# EAGLE design Rocketometer2148 MPU9150 (EAGLE 6.2)
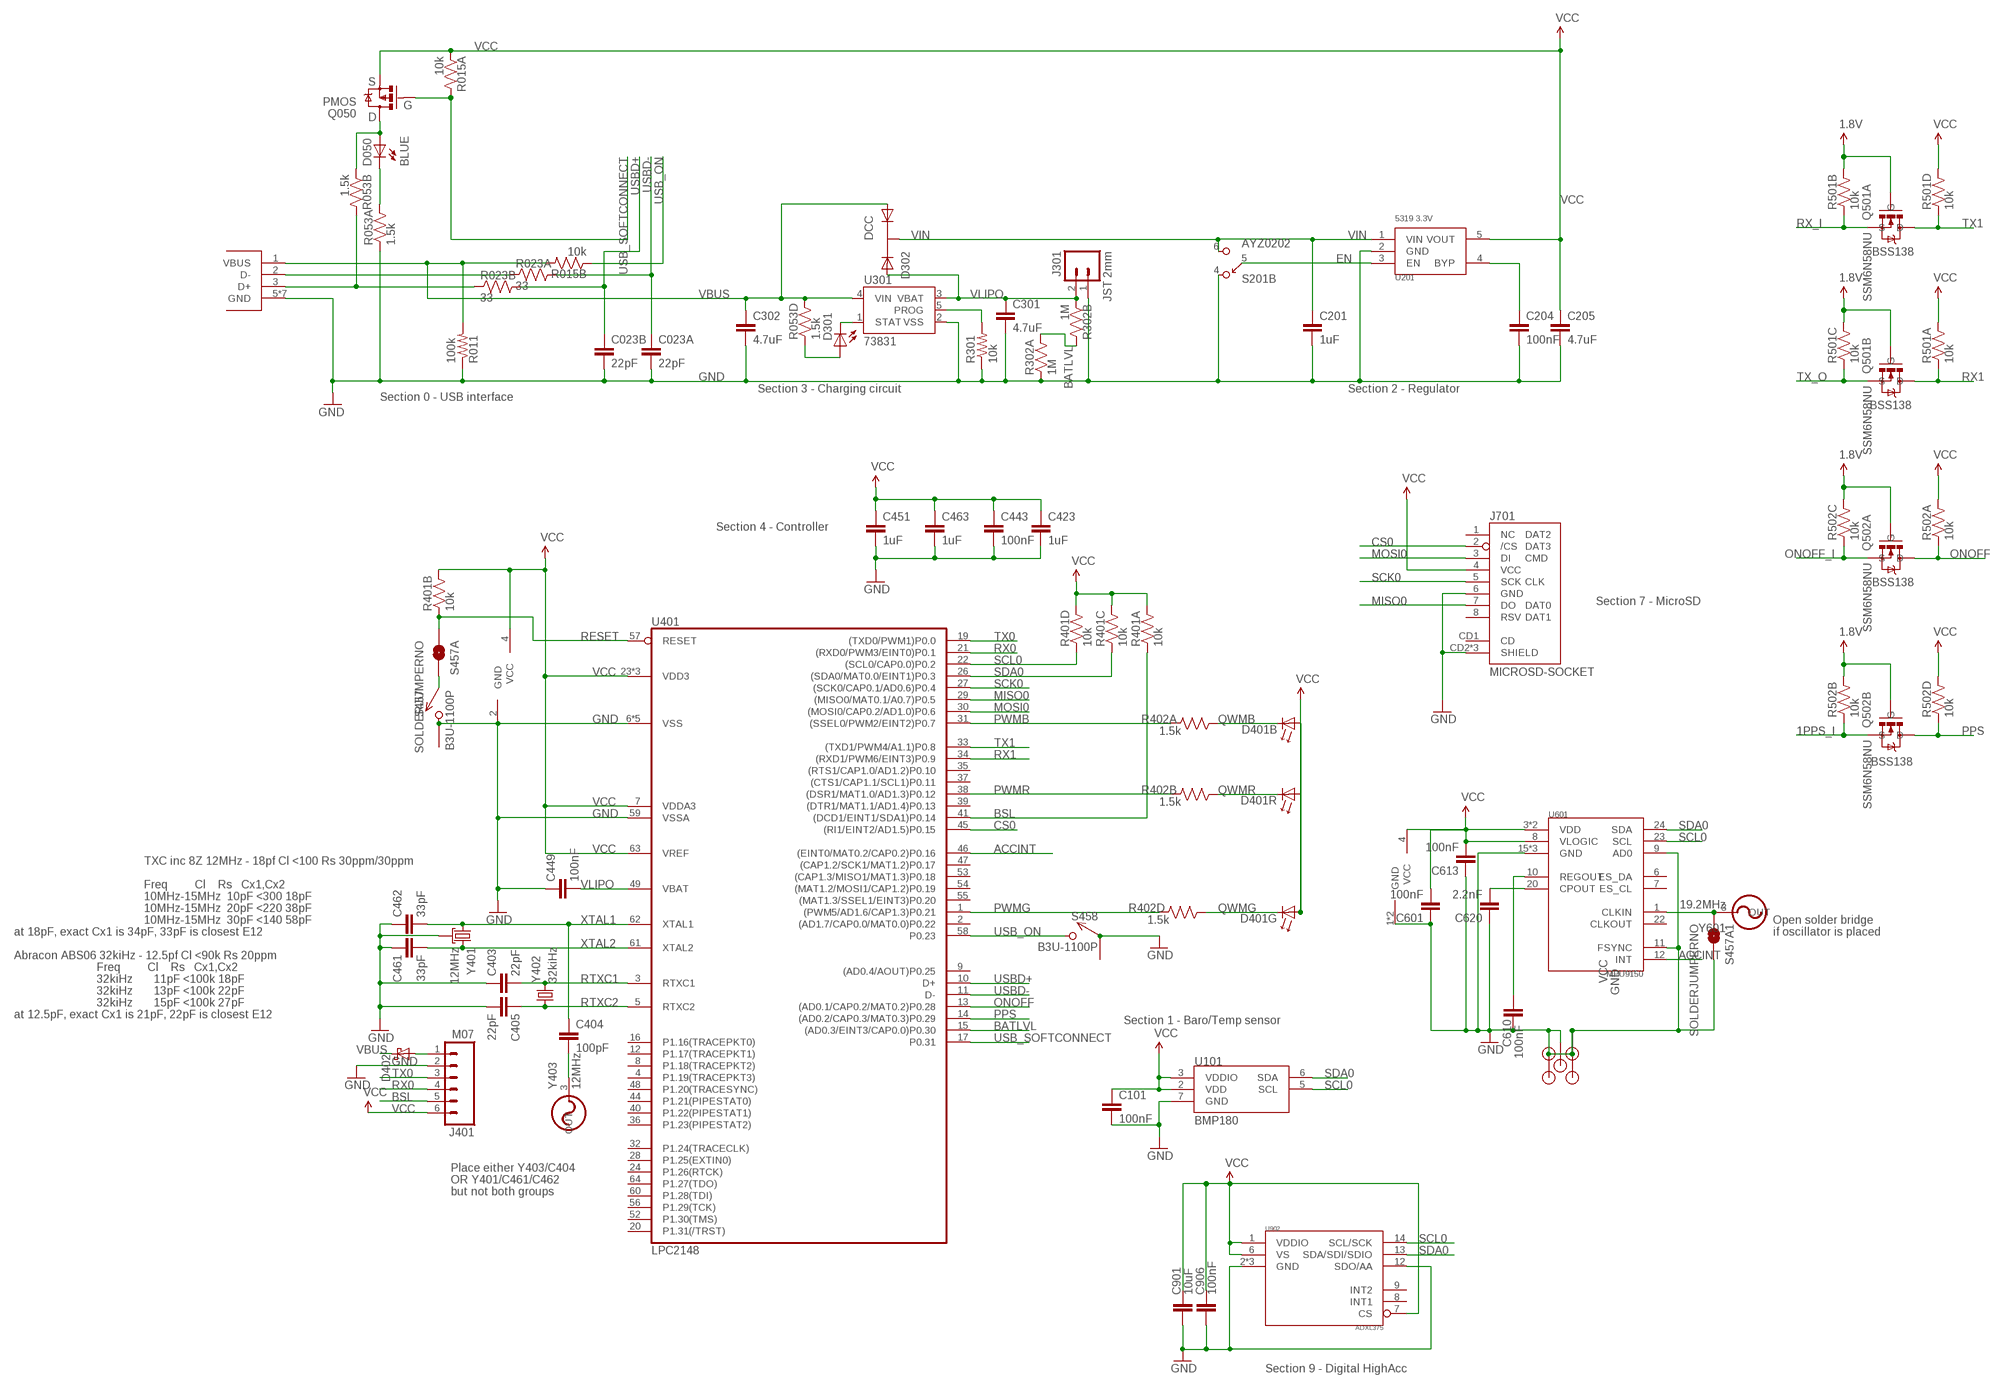
[diagram p0: schematic, sheet 1, part 1 of 2]
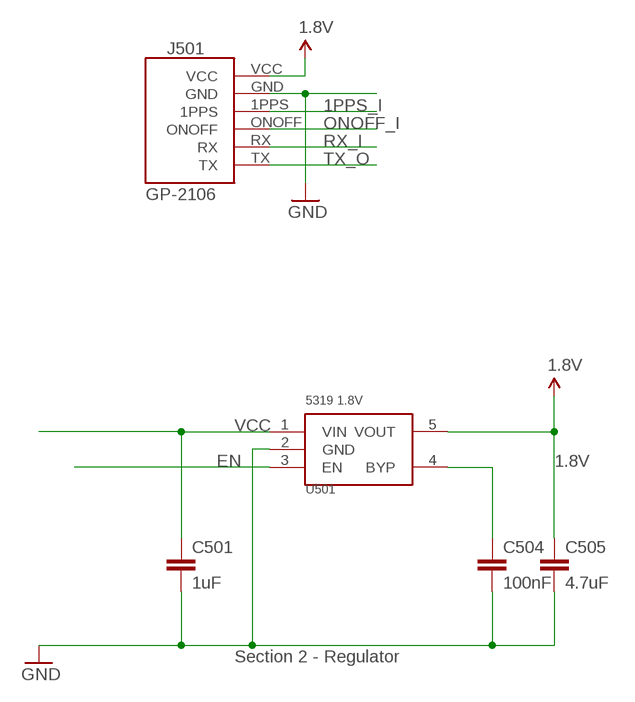
[diagram p1: schematic, sheet 1, part 2 of 2]

## Parts
C023  22pF  CKCM25  [CKCM25]
C101  100nF  CAP0402-CAP  [0402-CAP]
C201  1uF  CAP0402-CAP  [0402-CAP]
C204  100nF  CAP0402-CAP  [0402-CAP]
C205  4.7uF  CAP0402-CAP  [0402-CAP]
C301  4.7uF  CAP0402-CAP  [0402-CAP]
C302  4.7uF  CAP0402-CAP  [0402-CAP]
C403  22pF  CAP0402-CAP  [0402-CAP]
C404  100pF  CAP0402-CAP  [0402-CAP]
C405  22pF  CAP0402-CAP  [0402-CAP]
C423  1uF  CAP0402-CAP  [0402-CAP]
C443  100nF  CAP0402-CAP  [0402-CAP]
C449  100nF  CAP0402-CAP  [0402-CAP]
C451  1uF  CAP0402-CAP  [0402-CAP]
C461  33pF  CAP0402-CAP  [0402-CAP]
C462  33pF  CAP0402-CAP  [0402-CAP]
C463  1uF  CAP0402-CAP  [0402-CAP]
C501  1uF  CAP0402-CAP  [0402-CAP]
C504  100nF  CAP0402-CAP  [0402-CAP]
C505  4.7uF  CAP0402-CAP  [0402-CAP]
C601  100nF  CAP0402-CAP  [0402-CAP]
C610  100nF  CAP0402-CAP  [0402-CAP]
C613  100nF  CAP0402-CAP  [0402-CAP]
C620  2.2nF  CAP0402-CAP  [0402-CAP]
C901  10uF  CAP0603-CAP  [0603-CAP]
C906  100nF  CAP0402-CAP  [0402-CAP]
D050  BLUE  LED0603  [LED-0603]
D301  YELLOW  LED0603  [LED-0603]
D302  DCC  PMEG2005CT  [SOT-23-3]
D401  SMLP36RGB2W(R)  [SMLP36]
D402  DIODE_SCHOTTKY  [D0603]
J001  USB_MICROB_JSTGCT  [USB_MICROB_3075]
J301  JST 2mm  M02-JST-2MM-SMT  [JST-2-SMD]
J401  M07  M06SIP  [1X06]
J501  GP-2106  [GP-2106]
J701  MICROSD-SOCKET  [MICROSD-SOCKET-PP]
JP1  STANDOFF  [STANDOFF]
JP2  STANDOFF  [STANDOFF]
JP3  STANDOFF  [STANDOFF]
JP4  STANDOFF  [STANDOFF]
JP5  STANDOFF  [STANDOFF]
Q050  PMOS  MOSFET-PCHANNELSMD  [SOT23-3]
Q501  SSM6N58NU  [UDFN6]
Q502  SSM6N58NU  [UDFN6]
R011  100k  RESISTOR0402-RES  [0402-RES]
R015  10k  RP2EXB24V  [CRA02]
R023  33  RP2EXB24V  [CRA02]
R053  1.5k  RP404  [CRA04]
R301  10k  RESISTOR0402-RES  [0402-RES]
R302  1M  RP2EXB24V  [CRA02]
R401  10k  RP404  [CRA04]
R402  1.5k  RP404  [CRA04]
R501  10k  RP404  [CRA04]
R502  10k  RP404  [CRA04]
S201  AYZ0202  [AYZ0202]
S457  B3U-1100P  [B3U-1100P]
S457A  SOLDERJUMPERNO  [SJ_2S-NO]
S457A1  SOLDERJUMPERNO  [SJ_2S-NO]
S458  B3U-1100P  [B3U-1100P]
U101  BMP180  [BMP180]
U201  5319 3.3V  MIC5319D5  [SOT-23-5]
U301  73831  MCP73831  [SOT23-5]
U401  LPC2148  [LQFP64]
U501  5319 1.8V  MIC5319D5  [SOT-23-5]
U601  MPU9150  [LLGA24]
U902  ADXL375  [ADXL375]
Y401  12MHz  CX2520  [CRYSTAL_SMD_2MM_2_5MM]
Y402  32kiHz  ABS06  [ABS06]
Y403  12MHz  OSCILLATORE35MT  [CRYSTAL_SMD_5MM_3_2MM]
Y601  19.2MHz  OSCILLATORASDMB  [CRYSTAL_SMD_2MM_2_5MM]

## Nets
1.8V: C505.1 J501.VCC Q501.2(A:G) Q501.5(B:G) Q502.2(A:G) Q502.5(B:G) R501.6 R501.7 R502.6 R502.7 U501.5(VOUT)
1PPS_I: J501.1PPS Q502.4(B:S) R502.2
ACCINT: U401.46((EINT0/MAT0.2/CAP0.2)P0.16) U601.12(INT)
BATLVL: R302.3 R302.4 U401.15((AD0.3/EINT3/CAP0.0)P0.30)
BSL: J401.5 R401.1 U401.41((DCD1/EINT1/SDA1)P0.14)
CONN_D+: J001.3(D+) R023.2 R053.7
CONN_D-: J001.2(D-) R023.1
CS0: J701.2(/CS) U401.45((RI1/EINT2/AD1.5)P0.15)
EN: S201.5 U201.3(EN) U501.3(EN)
GND [power]: C023.3 C023.4 C101.2 C201.2 C204.2 C205.2 C301.2 C302.2 C403.1 C405.2 C423.2 C443.2 C449.1 C451.2 C461.1 C462.1 C463.2 C501.2 C504.2 C505.2 C601.1 C610.2 C613.1 C620.1 C901.2 C906.2 J001.5(GND) J001.P$1(GND) J001.P$2(GND) J001.P$3(GND) J001.P$4(GND) J001.P$8(GND) J001.P$10(GND) J301.1 J401.2 J501.GND J701.6(GND) J701.CD2(SHIELD) J701.GND1(SHIELD) J701.GND3(SHIELD) JP1.P$1 JP2.P$1 JP3.P$1 JP4.P$1 JP5.P$1 R011.1 R053.1 R301.1 R302.1 S201.4 S457.P$2 S457.P$3 S457A1.2 S458.P$1 S458.P$3 U101.7(GND) U201.2(GND) U301.2(VSS) U401.6(VSS) U401.18(VSS) U401.25(VSS) U401.42(VSS) U401.50(VSS) U401.59(VSSA) U501.2(GND) U601.9(AD0) U601.11(FSYNC) U601.15(GND) U601.17(GND) U601.18(GND) U902.2(GND) U902.4(GND) U902.5(GND) U902.12(SDO/AA) Y401.2(GND) Y401.4(GND) Y403.2(GND) Y601.1(GND) Y601.2(GND)
MISO0: J701.7(DO) U401.29((MISO0/MAT0.1/A0.7)P0.5)
MOSI0: J701.3(DI) U401.30((MOSI0/CAP0.2/AD1.0)P0.6)
N$1: C620.2 U601.20(CPOUT)
N$2: R301.2 U301.5(PROG)
N$3: D301.A R053.4
N$4: D301.C U301.1(STAT)
N$5: C404.2 Y403.3(OUT)
N$6: D050.A Q050.3(D) R053.2
N$7: D050.C R053.8
N$8 [power]: D402.A J401.1
N$9 [power]: S457.P$1 S457A.2
N$12: C504.1 U501.4(BYP)
N$13: C610.1 U601.10(REGOUT)
N$17: C204.1 U201.4(BYP)
ONOFF: Q502.6(A:D) R502.1 U401.13((AD0.1/CAP0.2/MAT0.2)P0.28)
ONOFF_I: J501.ONOFF Q502.1(A:S) R502.3
OSC_9DOF: S457A1.1 U601.1(CLKIN) Y601.3(OUT)
PPS: Q502.3(B:D) R502.4 U401.14((AD0.2/CAP0.3/MAT0.3)P0.29)
PWMB: R402.8 U401.31((SSEL0/PWM2/EINT2)P0.7)
PWMG: R402.5 U401.1((PWM5/AD1.6/CAP1.3)P0.21)
PWMR: R402.7 U401.38((DSR1/MAT1.0/AD1.3)P0.12)
QWMB: D401.1(B:C) R402.1
QWMG: D401.5(G:C) R402.4
QWMR: D401.3(R:C) R402.2
RESET [power]: R401.2 S457A.1 U401.57(RESET)
RTXC1: C403.2 U401.3(RTXC1) Y402.2
RTXC2: C405.1 U401.5(RTXC2) Y402.1
RX0: J401.4 U401.21((RXD0/PWM3/EINT0)P0.1)
RX1: Q501.3(B:D) R501.1 U401.34((RXD1/PWM6/EINT3)P0.9)
RX_I: J501.RX Q501.1(A:S) R501.2
SCK0: J701.5(SCK) U401.27((SCK0/CAP0.1/AD0.6)P0.4)
SCL0: R401.4 U101.5(SCL) U401.22((SCL0/CAP0.0)P0.2) U601.23(SCL) U902.14(SCL/SCK)
SDA0: R401.3 U101.6(SDA) U401.26((SDA0/MAT0.0/EINT1)P0.3) U601.24(SDA) U902.13(SDA/SDI/SDIO)
TX0: J401.3 U401.19((TXD0/PWM1)P0.0)
TX1: Q501.6(A:D) R501.4 U401.33((TXD1/PWM4/A1.1)P0.8)
TX_O: J501.TX Q501.4(B:S) R501.3
USB_ON: R015.2 S458.P$2 U401.58(P0.23)
USB_SOFTCONNECT: Q050.1(G) R015.4 U401.17(P0.31)
USBD+: C023.2 R023.3 U401.10(D+)
USBD-: C023.1 R023.4 U401.11(D-)
VBUS [power]: C302.1 D302.1(A1) D402.C(K) J001.1(VBUS) R011.2 R015.3 R053.5 U301.4(VIN)
VCC [power]: C101.1 C205.1 C423.1 C443.1 C451.1 C463.1 C501.1 C601.2 C613.2 C901.1 C906.1 D401.2(B:A) D401.4(R:A) D401.6(G:A) J401.6 J701.4(VCC) Q050.2(S) R015.1 R401.5 R401.6 R401.7 R401.8 R501.5 R501.8 R502.5 R502.8 U101.2(VDD) U101.3(VDDIO) U201.5(VOUT) U401.7(VDDA3) U401.23(VDD3) U401.43(VDD3) U401.51(VDD3) U401.63(VREF) U501.1(VIN) U601.3(VDD) U601.8(VLOGIC) U601.13(VDD) U902.1(VDDIO) U902.6(VS) U902.7(CS) Y403.4(VCC) Y601.4(VCC)
VIN: C201.1 D302.3(K) S201.6 U201.1(VIN)
VLIPO [power]: C301.1 C449.2 D302.2(A2) J301.2 R302.2 U301.3(VBAT) U401.49(VBAT)
XTAL1: C404.1 C462.2 U401.62(XTAL1) Y401.1
XTAL2: C461.2 U401.61(XTAL2) Y401.3
Unconnected: J701.1(NC) J701.8(RSV) J701.CD1(CD) R053.3 R053.6 R402.3 R402.6 S201.1 S201.2 S201.3 U401.2((AD1.7/CAP0.0/MAT0.0)P0.22) U401.4(P1.19(TRACEPKT3)) U401.8(P1.18(TRACEPKT2)) U401.9((AD0.4/AOUT)P0.25) U401.12(P1.17(TRACEPKT1)) U401.16(P1.16(TRACEPKT0)) U401.20(P1.31(/TRST)) U401.24(P1.26(RTCK)) U401.28(P1.25(EXTIN0)) U401.32(P1.24(TRACECLK)) U401.35((RTS1/CAP1.0/AD1.2)P0.10) U401.36(P1.23(PIPESTAT2)) U401.37((CTS1/CAP1.1/SCL1)P0.11) U401.39((DTR1/MAT1.1/AD1.4)P0.13) U401.40(P1.22(PIPESTAT1)) U401.44(P1.21(PIPESTAT0)) U401.47((CAP1.2/SCK1/MAT1.2)P0.17) U401.48(P1.20(TRACESYNC)) U401.52(P1.30(TMS)) U401.53((CAP1.3/MISO1/MAT1.3)P0.18) U401.54((MAT1.2/MOSI1/CAP1.2)P0.19) U401.55((MAT1.3/SSEL1/EINT3)P0.20) U401.56(P1.29(TCK)) U401.60(P1.28(TDI)) U401.64(P1.27(TDO)) U601.6(ES_DA) U601.7(ES_CL) U601.22(CLKOUT) U902.8(INT1) U902.9(INT2)

## Notes on the sheet
- S
- G
- D
- BSS138
- Section 0 - USB interface | Section 3 - Charging circuit | Section 2 - Regulator
- BSS138
- Section 4 - Controller
- BSS138
- Section 7 - MicroSD
- BSS138
- TXC inc 8Z 12MHz - 18pf Cl <100 Rs 30ppm/30ppm
- Freq         Cl    Rs   Cx1,Cx2
- 10MHz-15MHz  10pF <300 18pF | Section 2 - Regulator
- 10MHz-15MHz  20pF <220 38pF
- 10MHz-15MHz  30pF <140 58pF | Open solder bridge
- at 18pF, exact Cx1 is 34pF, 33pF is closest E12 | if oscillator is placed
- Abracon ABS06 32kiHz - 12.5pf Cl <90k Rs 20ppm
- Freq         Cl    Rs   Cx1,Cx2
- 32kiHz       11pF <100k 18pF
- 32kiHz       13pF <100k 22pF
- 32kiHz       15pF <100k 27pF
- at 12.5pF, exact Cx1 is 21pF, 22pF is closest E12
- Section 1 - Baro/Temp sensor
- Place either Y403/C404
- OR Y401/C461/C462
- but not both groups
- Section 9 - Digital HighAcc

## Library data of the parts
C023 = KwanSystems:CKC; DIGIKEY: 445-1860-1-ND
C101 C204 C443 C449 C504 C601 C610 C613 = SparkFun:CAP: Capacitor Standard 0603 ceramic capacitor, and 0.1" leaded capacitor.; DIGIKEY: 445-1265-1-ND
C201 C423 C451 C463 C501 = SparkFun:CAP: Capacitor Standard 0603 ceramic capacitor, and 0.1" leaded capacitor.; DIGIKEY: 445-4114-1-ND
C205 C301 C302 C505 = SparkFun:CAP: Capacitor Standard 0603 ceramic capacitor, and 0.1" leaded capacitor.; DIGIKEY: 445-7395-1-ND
C403-C405 = SparkFun:CAP: Capacitor Standard 0603 ceramic capacitor, and 0.1" leaded capacitor.; DIGIKEY: 445-1239-1-ND
C461 C462 = SparkFun:CAP: Capacitor Standard 0603 ceramic capacitor, and 0.1" leaded capacitor.; DIGIKEY: 445-1241-1-ND
C620 = SparkFun:CAP: Capacitor Standard 0603 ceramic capacitor, and 0.1" leaded capacitor.; DIGIKEY: 445-1257-1-ND
C901 = SparkFun:CAP: Capacitor Standard 0603 ceramic capacitor, and 0.1" leaded capacitor.; DIGIKEY: 445-7486-1-ND
C906 = SparkFun-Passives:CAP: Capacitor Standard 0603 ceramic capacitor, and 0.1" leaded capacitor.; DIGIKEY: 445-1265-1-ND
D050 = SparkFun:LED: LEDs Standard schematic elements and footprints for 5mm, 3mm, 1206, and 0603 sized LEDs. 5mm - Spark Fun Electronics SKU : COM-00529 (and others); DIGIKEY: 350-2037-1-ND
D301 = SparkFun:LED: LEDs Standard schematic elements and footprints for 5mm, 3mm, 1206, and 0603 sized LEDs. 5mm - Spark Fun Electronics SKU : COM-00529 (and others); DIGIKEY: 350-2032-1-ND
D302 = KwanSystems:PMEG2005CT; DIGIKEY: 568-6500-1-ND
D401 = KwanSystems:SMLP36RGB2W(R); DIGIKEY: 846-1097-1-ND
D402 = KwanSystems:DIODE_SCHOTTKY
J001 = KwanSystems:USB_MICROB_JST; DIGIKEY: 609-4616-2-ND
J301 = SparkFun:M02: Header 2 Standard 2-pin 0.1" header. Use with straight break away headers (SKU : PRT-00116), right angle break away headers (PRT-00553), swiss pins (PRT-00743), machine pins (PRT-00117), and female headers (PRT-00115). Molex polarized connector foot print use with SKU : PRT-08233 with associated crimp pins and housings.; DIGIKEY: 455-1749-1-ND
J401 = SparkFun-Connectors:M06: Header 6 Standard 6-pin 0.1" header. Use with straight break away headers (SKU : PRT-00116), right angle break away headers (PRT-00553), swiss pins (PRT-00743), machine pins (PRT-00117), and female headers (PRT-00115). Molex polarized connector foot print use with SKU : PRT-08094 with associated crimp pins and housings. NOTES ON THE VARIANTS LOCK and LOCK_LONGPADS... This footprint was designed to help hold the alignment of a through-hole component (i.e. 6-pin header) while soldering it into place. You may notice that each hole has been shifted either up or down by 0.005 of an inch from it's more standard position (which is a perfectly straight line). This slight alteration caused the pins (the squares in the middle) to touch the edges of the holes. Because they are alternating, it causes a "brace" to hold the component in place. 0.005 has proven to be the perfect amount of "off-center" position when using our standard breakaway headers. Although looks a little odd when you look at the bare footprint, once you have a header in there, the alteration is very hard to notice. Also,if you push a header all the way into place, it is covered up entirely on the bottom side. This idea of altering the position of holes to aid alignment will be further integrated into the Sparkfun Library for other footprints. It can help hold any component with 3 or more connection pins.; DIGIKEY: $NOPART
J501 = SparkFun:GP-2106: GP-2106 GPS SiRF IV
J701 = KwanSystems:MICROSD-SOCKET: microSD Socket Push-push type uSD socket. Digikey 101-00660-68-6-1-ND. tDoc lines correctly indicate media card edge positions when inserting (unlocked, locked, depressed).; DIGIKEY: 101-00581-59-1-ND
JP1-JP5 = KwanSystems:STANDOFF; DIGIKEY: $NOPART
Q050 = SparkFun:MOSFET-PCHANNEL; DIGIKEY: NTR1P02T1GOSCT-ND
Q501 Q502 = KwanSystems:SSM6N58NU
R011 = SparkFun:RESISTOR: Resistor Basic schematic elements and footprints for 0603, 1206, and PTH resistors.; DIGIKEY: P100KLCT-ND
R015 = KwanSystems:RP2; DIGIKEY: Y5103CT-ND
R023 R302 = KwanSystems:RP2
R053 R402 = KwanSystems:RP4; DIGIKEY: CRA4S81.5KCT-ND
R301 = SparkFun:RESISTOR: Resistor Basic schematic elements and footprints for 0603, 1206, and PTH resistors.; DIGIKEY: P10.0KLCT-ND
R401 R501 R502 = KwanSystems:RP4; DIGIKEY: CRA4S810KCT-ND
S201 = KwanSystems:AYZ0202; DIGIKEY: 401-2013-1-ND
S457 S458 = KwanSystems:B3U-1100P; DIGIKEY: SW1021CT-ND
S457A S457A1 = SparkFun-Passives:SOLDERJUMPER: Solder Jumper Standard SMD solder jumper. Used to automate production. Two varients : Normally Open and Normally Closed are the same, but have different paste layers. NC will have a large amount of paste and should jumper during reflow.; DIGIKEY: $NOPART
U101 = KwanSystems:BMP180; DIGIKEY: 828-1027-1-ND
U201 U501 = KwanSystems:MIC5319; DIGIKEY: 576-1910-1-ND
U301 = SparkFun:MCP73831: Microchip's MCP73831 Miniature single cell, fully integrated Li-Ion, Li-polymer charge management controller http://ww1.microchip.com/downloads/en/DeviceDoc/21984a.pdf; DIGIKEY: MCP73831T-2ACI/OTCT-ND
U401 = KwanSystems:LPC2148
U601 = KwanSystems:MPU9150; DIGIKEY: $NOPART
U902 = KwanSystems:ADXL375; DIGIKEY: ADXL375BCCZ-ND
Y401 = KwanSystems:CX2520; DIGIKEY: 887-1487-1-ND
Y402 = KwanSystems:ABS06; DIGIKEY: 535-10104-1-ND
Y403 = KwanSystems:OSCILLATOR: EM53T temperature compensated oscillator (TCXO) This part contains a crystal and all the rest of the electronics needed to directly produce a clock signal. Temperature compensation means that the part maintains +-2ppm over a wide temperature range.; DIGIKEY: 631-1068-1-ND
Y601 = KwanSystems:OSCILLATOR: EM53T temperature compensated oscillator (TCXO) This part contains a crystal and all the rest of the electronics needed to directly produce a clock signal. Temperature compensation means that the part maintains +-2ppm over a wide temperature range.

## Net classes
0 default: width 0.152 mm, drill 0.33 mm, clearance 0.152 mm
1 power: width 0.152 mm, drill 0.33 mm, clearance 0.152 mm to class 0, clearance 0.152 mm
2 hv: width 0.152 mm, drill 0.33 mm, clearance 0.152 mm to class 0, clearance 0.152 mm to class 1, clearance 0.152 mm

## Board
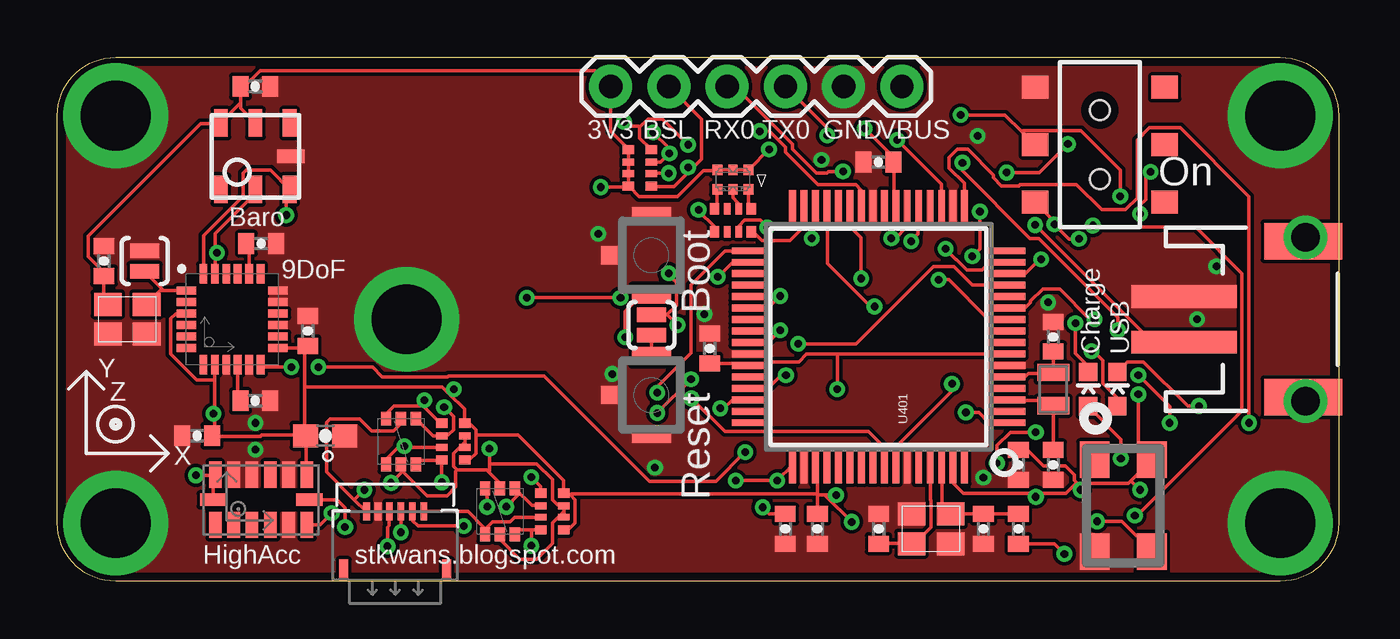
[diagram p2: board, top side]
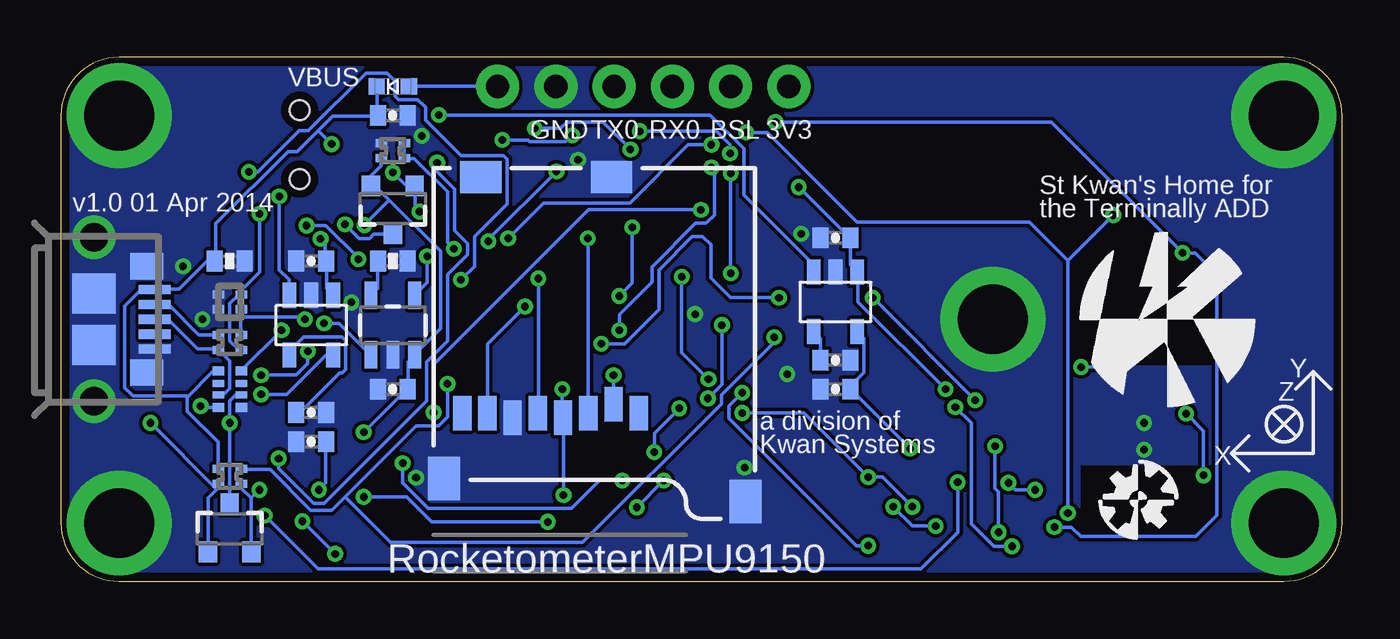
[diagram p3: board, bottom side, seen from below]

Size 55.88 x 22.86 mm. Coordinates in mm from the lower left corner, seen from the top.
Outline: 2.54,22.86 53.34,22.86 arc-90 55.88,20.32 55.88,2.54 arc-90 53.34,0 2.54,0 arc-90 0,2.54 0,20.32 arc-90 2.54,22.86
Copper layers (1*16): Top 0.0356mm / dielectric 1.5011mm / Bottom 0.0356mm
Design rules: minimum track width 6mil, minimum drill 13mil, track to track 6mil, track to pad 6mil, pad to pad 6mil, via to via 6mil, smd to smd 6mil, copper to edge 15mil, drill to drill 6mil, minimum pad ring 7mil, minimum via ring 7mil, stop-mask expansion 4mil, vias tented up to drill 14mil, thermal gap 10mil

### Footprints (pad centres in the part's own frame; a part is rotated, then mirrored left to right if it is on the bottom)
CKCM25 = smd 0.35 x 0.5: 1 -0.325,-0.5; 2 0.325,-0.5; 3 0.325,0.5; 4 -0.325,0.5
0402-CAP = smd 0.7 x 0.9: 1 -0.65,0; 2 0.65,0
0603-CAP = smd 1.1 x 1: 1 -0.85,0; 2 0.85,0
LED-0603 = smd 0.8 x 0.8: A 0,-0.75; C 0,0.75
SOT-23-3 = smd 0.9 x 0.8: 1 -1,0.95; 2 -1,-0.95; 3 1.1,0
SMLP36 = smd 0.45 x 0.45: 1 -0.675,0.425; 2 -0.675,-0.425; 5 0.675,0.425; 6 0.675,-0.425 | smd 0.4 x 0.45: 3 0,0.425; 4 0,-0.425
D0603 = smd 0.7 x 0.7: A -0.7,0; C 0.7,0
USB_MICROB_3075 = smd 0.4 x 1.4: 1 -1.3,4.1; 2 -0.65,4.1; 3 0,4.1; 4 0.65,4.1; 5 1.3,4.1 | smd 1.15 x 1.45: P$1 2.32,3.75; P$10 -2.32,3.75 | smd 1.75 x 1.9: P$2 1.125,1.45; P$8 -1.125,1.45 | drill 1.25 pad 1.9: P$3 -3.575,1.45; P$4 3.575,1.45
JST-2-SMD = smd 1 x 4.6: 1 -1,-3.7; 2 1,-3.7 | smd 1.6 x 3.4: NC1 -3.4,1.5; NC2 3.4,1.5
1X06 = drill 1.016 pad 1.88: 1 0,0; 2 2.54,0; 3 5.08,0; 4 7.62,0; 5 10.16,0; 6 12.7,0
GP-2106 = smd 0.3 x 0.8: 1PPS -0.25,0; GND -0.75,0; ONOFF 0.25,0; RX 0.75,0; TX 1.25,0; VCC -1.25,0 | smd 0.4 x 0.8: P$7 -2.25,-2.5; P$8 2.25,-2.5
MICROSD-SOCKET-PP = smd 0.8 x 1.5: 1 -8.94,10.7; 2 -7.84,10.3; 3 -6.74,10.7; 4 -5.64,10.9; 5 -4.54,10.7; 6 -3.44,10.9; 7 -2.34,10.7; 8 -1.24,10.7 | smd 1.8 x 1.4: CD1 -2.05,0.4; CD2 -7.75,0.4 | smd 1.4 x 1.9: GND1 -13.6,14.55; GND3 -0.45,13.55
STANDOFF = drill 3.048 pad 4.572: P$1 0,0
SOT23-3 = smd 0.8 x 0.9: 1 -0.95,-1; 2 0.95,-1; 3 0,1.1
UDFN6 = smd 0.45 x 0.6: 1 -0.65,-1; 2 0,-1; 3 0.65,-1; 4 0.65,1; 5 0,1; 6 -0.65,1
0402-RES = smd 0.7 x 0.9: 1 -0.65,0; 2 0.65,0
CRA02 = smd 0.35 x 0.5: 1 -0.325,-0.5; 2 0.325,-0.5; 3 0.325,0.5; 4 -0.325,0.5
CRA04 = smd 0.4 x 0.5: 1 -0.8,-0.5; 4 0.8,-0.5; 5 0.8,0.5; 8 -0.8,0.5 | smd 0.3 x 0.5: 2 -0.25,-0.5; 3 0.25,-0.5; 6 0.25,0.5; 7 -0.25,0.5
AYZ0202 = smd 1 x 1.15: 1 -2.5,2.825; 2 0,2.825; 3 2.5,2.825; 4 -2.5,-2.825; 5 0,-2.825; 6 2.5,-2.825 | hole 0.85: 1.5,0; -1.5,0
B3U-1100P = smd 0.8 x 1.7: P$1 -1.7,0; P$2 1.7,0 | smd 0.8 x 1.1: P$3 0,-1.65
SJ_2S-NO = smd 0.635 x 1.27: 1 -0.45,0; 2 0.45,0
BMP180 = smd 0.6 x 1.2: 1 1.5,1.45; 2 0,1.45; 3 -1.5,1.45; 4 -1.5,-1.45; 5 0,-1.45; 6 1.5,-1.45 | smd 1.2 x 0.6: 7 1.55,0
SOT-23-5 = smd 0.6 x 1.1: 1 -0.95,-1.3; 2 0,-1.3; 3 0.95,-1.3; 4 0.95,1.3; 5 -0.95,1.3
SOT23-5 = smd 0.55 x 1.2: 1 -0.95,-1.3; 2 0,-1.3; 3 0.95,-1.3; 4 0.95,1.3; 5 -0.95,1.3
LQFP64 = smd 0.3 x 1.6: 1 -3.75,-5.6; 2 -3.25,-5.6; 3 -2.75,-5.6; 4 -2.25,-5.6; 5 -1.75,-5.6; 6 -1.25,-5.6; 7 -0.75,-5.6; 8 -0.25,-5.6; 9 0.25,-5.6; 10 0.75,-5.6; 11 1.25,-5.6; 12 1.75,-5.6; 13 2.25,-5.6; 14 2.75,-5.6; 15 3.25,-5.6; 16 3.75,-5.6; 33 3.75,5.6; 34 3.25,5.6; 35 2.75,5.6; 36 2.25,5.6; 37 1.75,5.6; 38 1.25,5.6; 39 0.75,5.6; 40 0.25,5.6; 41 -0.25,5.6; 42 -0.75,5.6; 43 -1.25,5.6; 44 -1.75,5.6; 45 -2.25,5.6; 46 -2.75,5.6; 47 -3.25,5.6; 48 -3.75,5.6 | smd 1.6 x 0.3: 17 5.6,-3.75; 18 5.6,-3.25; 19 5.6,-2.75; 20 5.6,-2.25; 21 5.6,-1.75; 22 5.6,-1.25; 23 5.6,-0.75; 24 5.6,-0.25; 25 5.6,0.25; 26 5.6,0.75; 27 5.6,1.25; 28 5.6,1.75; 29 5.6,2.25; 30 5.6,2.75; 31 5.6,3.25; 32 5.6,3.75; 49 -5.6,3.75; 50 -5.6,3.25; 51 -5.6,2.75; 52 -5.6,2.25; 53 -5.6,1.75; 54 -5.6,1.25; 55 -5.6,0.75; 56 -5.6,0.25; 57 -5.6,-0.25; 58 -5.6,-0.75; 59 -5.6,-1.25; 60 -5.6,-1.75; 61 -5.6,-2.25; 62 -5.6,-2.75; 63 -5.6,-3.25; 64 -5.6,-3.75
LLGA24 = smd 0.85 x 0.34: 1 -2,1.25; 2 -2,0.75; 3 -2,0.25; 4 -2,-0.25; 5 -2,-0.75; 6 -2,-1.25; 13 2,-1.25; 14 2,-0.75; 15 2,-0.25; 16 2,0.25; 17 2,0.75; 18 2,1.25 | smd 0.34 x 0.85: 7 -1.25,-1.975; 8 -0.75,-1.975; 9 -0.25,-1.975; 10 0.25,-1.975; 11 0.75,-1.975; 12 1.25,-1.975; 19 1.25,1.975; 20 0.75,1.975; 21 0.25,1.975; 22 -0.25,1.975; 23 -0.75,1.975; 24 -1.25,1.975
ADXL375 = smd 0.55 x 1.145: 1 2,1.097; 2 1.2,1.097; 3 0.4,1.097; 4 -0.4,1.097; 5 -1.2,1.097; 6 -2,1.097; 8 -2,-1.097; 9 -1.2,-1.097; 10 -0.4,-1.097; 11 0.4,-1.097; 12 1.2,-1.097; 13 2,-1.097 | smd 1.145 x 0.55: 7 -2.098,0; 14 2.098,0
CRYSTAL_SMD_2MM_2_5MM = smd 1.2 x 1: 1 -0.85,-0.65; 2 0.85,-0.65; 3 0.85,0.65; 4 -0.85,0.65
ABS06 = smd 0.75 x 1.4: 1 -0.725,0; 2 0.725,0
CRYSTAL_SMD_5MM_3_2MM = smd 1.6 x 1.3: 1 -2,-1.25; 2 2,-1.25; 3 2,1.25; 4 -2,1.25

### Placement (x,y rotation side)
C023  48.51,12.19 90 bottom
C101  8.64,21.59 0 top
C201  44.96,13.97 180 bottom
C204  44.96,7.37 0 bottom
C205  44.96,6.1 180 bottom
C301  41.4,8.38 180 bottom
C302  41.4,20.32 0 bottom
C403  43.43,5.08 90 top
C404  41.91,2.29 270 top
C405  43.43,10.67 90 top
C423  35.81,18.29 180 top
C443  28.45,10.16 90 top
C449  31.75,2.29 90 top
C451  33.15,2.29 270 top
C461  35.81,2.29 270 top
C462  40.39,2.29 90 top
C463  41.91,5.08 270 top
C501  22.1,14.99 180 bottom
C504  22.1,9.65 0 bottom
C505  22.1,8.38 180 bottom
C601  2.03,13.97 270 top
C610  8.64,7.87 0 top
C613  10.92,10.92 270 top
C620  8.89,14.73 180 top
C901  11.68,6.35 0 top
C906  6.1,6.35 180 top
D050  46.23,8.38 0 top
D301  44.96,8.38 0 top
D302  41.4,16.26 270 bottom
D401  29.46,17.53 180 top
D402  41.4,21.59 180 bottom
J001  55.88,11.43 270 bottom
J301  52.83,11.43 270 top
J401  36.83,21.59 180 top
J501  14.73,3.05 0 top
J701  39.62,18.03 180 bottom
JP1  2.54,2.54 0 top
JP2  2.54,20.32 0 top
JP3  15.24,11.43 0 top
JP4  53.34,2.54 0 top
JP5  53.34,20.32 0 top
Q050  48.51,2.29 0 bottom
Q501  19.3,3.05 180 top
Q502  14.99,6.1 0 top
R011  48.51,13.97 180 bottom
R015  48.51,4.57 90 bottom
R023  48.51,10.41 270 bottom
R053  48.51,8.38 90 bottom
R301  41.4,13.97 180 bottom
R302  41.4,18.8 270 bottom
R401  25.4,18.03 90 top
R402  29.46,15.75 180 top
R501  21.59,3.05 270 top
R502  17.27,6.1 270 top
S201  45.47,19.05 270 top
S457  25.91,8.13 270 top
S457A  25.91,11.18 270 top
S457A1  3.81,13.97 90 top
S458  25.91,14.22 270 top
U101  8.64,18.54 0 top
U201  44.96,11.18 180 bottom
U301  41.4,11.18 0 bottom
U401  35.81,10.67 90 top
U501  22.1,12.19 180 bottom
U601  7.62,11.43 0 top
U902  8.89,3.56 0 top
U$4  [AXES]  1.27,5.59 0 top
U$5  [KWAN_ACC]  7.62,11.43 0 bottom
U$6  [OSHW_ACC]  8.89,3.56 0 bottom
Y401  38.1,2.29 180 top
Y402  43.43,8.38 270 top
Y403  46.48,3.3 270 top
Y601  3.05,11.43 0 top

### Tracks (layer width: path | path; a pad name or v marks a point on that pad's centre or on a via)
1.8V  (via drill 0.33)
  Top 0.152: Q502.5 14.99,6.88 14.66,6.55 13.72,6.55 13.18,7.09 11.89,7.09 11.73,6.93 11.73,4.78 12.95,3.56 | 12.95,3.56 13.46,3.05 J501.VCC | 22.1,3 22.1,3.28 R501.7 22.02,3.33 21.82,3.33 21.59,3.56 21.59,4.45 20.9,5.13 18.85,5.13 | 22.1,3 22.1,2.82 R501.6 | Q501.5 19.3,1.83 20.17,0.96 20.9,0.96 21.59,1.65 21.59,2.54 22.05,3 22.1,3 | 17.78,6.04 17.78,6.33 R502.7 | 17.78,6.04 17.78,5.87 R502.6 | Q501.2 19.3,4.27 18.8,4.78 | 18.8,4.78 18.72,4.85 17.42,4.85 | 17.42,4.85 17.27,5 17.27,5.59 17.73,6.04 17.78,6.04 | Q502.2 14.99,4.88 15.06,4.8 | 15.06,4.8 16.13,3.73 16.99,3.73 17.37,4.12 17.37,4.8 17.42,4.85 | 18.85,5.13 18.85,4.83 18.8,4.78 | 18.85,5.13 v18.85,5.79 | v13.39,3.99 12.95,3.56 | 15.06,4.8 v14.55,4.29
  Bottom 0.152: U501.5 21.13,10.87 20.85,10.59 20.85,9.12 21.44,8.53 21.44,8.38 C505.1 21.39,8.33 v18.85,5.79 | v13.39,3.99 14.25,3.99 v14.55,4.29
1PPS_I  (via drill 0.33)
  Top 0.152: Q502.4 15.65,7.09 16.38,6.35 R502.2 16.84,6.38 17.04,6.38 17.27,6.6 17.27,7.19 v16.87,7.59 | v14.4,1.52 14.4,2.36 14.48,2.44 J501.1PPS
  Bottom 0.152: v14.4,1.52 15.19,1.52 16.18,2.52 16.18,6.91 v16.87,7.59
ACCINT  (via drill 0.33)
  Top 0.152: v10.21,9.35 9.04,9.35 8.94,9.45 8.89,9.45 U601.12 | v11.38,9.35 13.74,9.35 14.17,8.91 17.02,8.91 17.07,8.97 21.23,8.97 25.83,4.37 28.73,4.37 v30,5.64 | v28.91,7.54 29.06,7.54 29.41,7.9 30.2,7.9 U401.46
  Bottom 0.152: v11.38,9.35 v10.21,9.35 | v30,5.64 30,6.45 v28.91,7.54
BATLVL  (via drill 0.33)
  Top 0.152: v38.73,14.5 39.19,14.05 39.22,14.05 39.67,13.59 40.31,13.59 40.62,13.89 41.4,13.89 U401.15
  Bottom 0.152: R302.4 40.92,19.1 40.92,18.49 R302.3 40.84,18.44 40.46,18.44 39.01,16.99 39.01,14.78 v38.73,14.5
BSL  (via drill 0.33)
  Top 0.152: 27.62,17.95 28.09,18.41 28.09,20.17 J401.5 | 27.62,17.95 26.9,17.22 R401.1 | v31.52,10.95 31.01,10.44 30.23,10.44 U401.41 | 27.62,17.95 v27.51,18.06
  Bottom 0.152: v31.52,10.95 31.52,11.63 30.1,13.06 30.1,13.72 28.19,15.62 27.74,15.62 27.38,15.98 27.38,17.93 v27.51,18.06
CONN_D+
  Bottom 0.152: R053.7 49,8.15 48.77,8.15 48.51,8.41 48.51,9.6 49,10.08 R023.2 49.07,10.13 49.91,10.13 51.21,11.43 J001.3
CONN_D-
  Bottom 0.152: R023.1 49.02,10.74 49.86,10.74 51.18,12.06 51.77,12.06 J001.2
CS0  (via drill 0.33)
  Top 0.152: v31.77,8.99 31.57,8.99 31.01,8.43 30.23,8.43 U401.45
  Bottom 0.152: v31.77,8.99 31.77,7.75 J701.2
EN  (via drill 0.33)
  Top 0.152: v39.4,20.34 41.33,20.34 42.06,19.61 | 42.06,19.61 42.62,19.05 S201.5 | v46.35,16.79 46.35,17.93 44.63,19.66 42.11,19.66 42.06,19.61
  Bottom 0.152: v39.4,20.34 27.56,20.34 26.09,18.87 26.09,16.84 23.06,13.82 23.06,13.51 U501.3 | v46.35,16.79 46.35,13.59 45.92,13.16 45.92,12.5 U201.3
GND  (via drill 0.33)
  other vias: 49.71,11.43 50.55,13.74 40.13,19.43 8.64,6.91 8.64,5.74 43.21,12.17 28.22,11.66 23.6,15.16 24.21,9.04 26.06,4.95 40.39,4.52 33.32,18.39
  pour Top (no thermals): 2.54,22.86 53.34,22.86 55.88,22.86 55.88,2.54 arc-90 53.34,0 2.54,0 arc-90 0,2.54 0,20.32 arc-90
  pour Bottom (no thermals): 2.54,22.86 53.34,22.86 55.88,22.86 55.88,2.54 arc-90 53.34,0 2.54,0 arc-90 0,2.54 0,20.32 arc-90
MISO0  (via drill 0.33)
  Top 0.152: v35.64,11.99 35.46,11.99 33.58,13.87 33.58,16.26 U401.29
  Bottom 0.152: v35.64,11.99 37.26,10.36 37.26,7.34 J701.7
MOSI0  (via drill 0.33)
  Top 0.152: v32.89,14.96 32.89,15.32 33.05,15.47 33.05,16.26 U401.30
  Bottom 0.152: v32.89,14.96 32.89,7.34 J701.3
N$1
  Top 0.152: U601.20 8.36,13.41 8.36,14.63 8.26,14.73 C620.2
N$2
  Bottom 0.152: R301.2 42.06,13.97 42.06,12.78 42.34,12.5 U301.5
N$3  (via drill 0.33)
  Top 0.152: v46.25,10.95 46.25,11.51 42.8,14.96 42.42,14.96 39.47,17.91 v39.47,18.26 | v46.38,5.36 46.38,6.2 D301.A
  Bottom 0.152: v46.25,10.95 48.01,9.2 R053.4 | v39.47,18.26 39.47,17.88 38.71,17.12 38.71,15.29 38.15,14.73 38.15,14.25 39.01,13.39 39.01,10.49 39.93,9.58 39.93,7.87 44.4,3.4 44.86,3.4 46.38,4.93 v46.38,5.36
N$4  (via drill 0.33)
  Top 0.152: D301.C 44.96,9.37 44.4,9.93 v44.4,11.25
  Bottom 0.152: v44.4,11.25 43.74,11.25 42.37,9.88 U301.1
N$5  (via drill 0.33)
  Top 0.152: v43.92,1.19 43.48,1.63 41.91,1.63 C404.2 | v45.34,2.62 46.43,2.62 47.73,1.32 Y403.3
  Bottom 0.152: v45.34,2.62 v43.92,1.19
N$6  (via drill 0.33)
  Top 0.152: D050.A 46.23,8 45.59,8.64 45.59,9.63 45.19,10.03 v45.11,10.03 | v47.14,8.99 48.51,7.62 v48.51,6.91
  Bottom 0.152: Q050.3 v48.51,6.91 48.51,7.87 48.26,8.13 48.03,8.13 R053.2 | v45.11,10.03 45.11,9.5 45.62,8.99 v47.14,8.99
N$7  (via drill 0.33)
  Top 0.152: v49.78,7.64 49.3,7.64 47.37,9.58 46.66,9.58 46.23,9.14 D050.C
  Bottom 0.152: v49.78,7.64 49.73,7.59 49.02,7.59 R053.8
N$8
  Bottom 0.152: J401.1 D402.A
N$9
  Top 0.152: S457.P$1 S457A.2
N$12
  Bottom 0.152: C504.1 22.76,10.59 23.04,10.87 U501.4
N$13
  Top 0.152: U601.10 7.87,7.98 7.98,7.87 C610.1
N$17
  Bottom 0.152: C204.1 45.44,7.37 43.71,9.09 43.61,9.09 43.46,9.25 43.46,10.52 43.61,10.67 45.29,10.67 45.9,10.06 45.9,9.88 U201.4
ONOFF  (via drill 0.33)
  Top 0.152: 15.95,7.64 16.69,6.91 R502.1 | 15.95,7.64 14.68,7.64 14.35,7.32 14.35,7.11 Q502.6 | v16,7.9 16,7.7 15.95,7.64 | v24.56,12.37 v20.47,12.37 | v32.31,10.36 34.82,10.36 38.2,13.74 39.09,13.74 39.9,12.93 U401.13
  Bottom 0.152: v20.47,12.37 v16,7.9 | v24.56,12.37 26.67,12.37 27.53,13.23 27.53,14.68 27.89,15.04 28.35,15.04 29.79,13.59 29.79,11.86 31.29,10.36 v32.31,10.36
ONOFF_I  (via drill 0.33)
  Top 0.152: 15.14,5.84 14.86,5.84 14.35,5.33 14.35,5.11 Q502.1 | 15.14,5.84 R502.3 | v14.99,2.13 J501.ONOFF | v15.14,5.89 15.14,5.84
  Bottom 0.152: v14.99,2.13 14.99,3.91 15.14,4.06 v15.14,5.89
OSC_9DOF
  Top 0.152: 4.6,12.68 4.5,12.68 3.91,12.09 Y601.3 | 4.6,12.68 U601.1 | S457A1.1 4.6,12.72 4.6,12.68
PPS  (via drill 0.33)
  Top 0.152: Q502.3 15.82,5.28 16.76,5.28 R502.4 16.76,5.21 v16.76,4.32 | v46.99,2.87 47.09,2.87 51.66,7.44 51.66,13.44 49.66,15.44 45.24,15.44 v45.16,15.52 | v42.9,14.05 42.82,14.05 42.22,13.44 41.43,13.44 U401.14
  Bottom 0.152: v16.76,4.32 16.76,2.13 18.36,0.53 44.65,0.53 v46.99,2.87 | v45.16,15.52 44.32,15.52 42.9,14.1 v42.9,14.05
PWMB
  Top 0.152: R402.8 30.28,15.24 30.35,15.24 30.73,14.86 31.95,14.86 32.56,15.47 32.56,16.26 U401.31
PWMG  (via drill 0.33)
  Top 0.152: v27.96,16.2 27.96,16.15 28.65,15.47 28.65,15.27 R402.5 | v39.62,7.37 40.18,7.37 40.62,6.93 41.4,6.93 U401.1
  Bottom 0.152: v27.96,16.2 32.87,16.2 39.62,9.45 v39.62,7.37
PWMR  (via drill 0.33)
  Top 0.152: v30.96,15.44 30.66,15.75 29.97,15.75 29.72,15.49 29.72,15.27 R402.7 | v31.52,12.45 31.01,11.94 30.23,11.94 U401.38
  Bottom 0.152: v30.96,15.44 30.96,13.01 v31.52,12.45
QWMB
  Top 0.152: D401.1 30.15,16.36 R402.1
QWMG
  Top 0.152: D401.5 28.78,17.09 28.78,16.36 28.68,16.26 R402.4
QWMR
  Top 0.152: D401.3 29.46,16.74 29.69,16.51 29.69,16.26 R402.2
RESET  (via drill 0.33)
  Top 0.152: v26.67,17.8 25.91,17.8 R401.2 | v26.67,13.44 26.67,13.36 27,13.03 27,12.04 26.59,11.63 | 26.59,11.63 S457A.1 | v27.66,7.98 29.11,6.53 35.38,6.53 36.04,5.87 36.04,5.08 U401.57 | 26.59,11.63 v27.05,11.18
  Bottom 0.152: v26.67,13.44 v26.67,17.8 | v27.66,7.98 27.05,8.59 v27.05,11.18
RTXC1
  Top 0.152: C403.2 Y402.2 43.38,7.7 43.18,7.9 41.43,7.9 U401.3
RTXC2
  Top 0.152: C405.1 Y402.1 43.38,9.07 42.34,9.07 42.22,8.94 41.43,8.94 U401.5
RX0  (via drill 0.33)
  Top 0.152: v37.24,14.83 37.54,15.14 37.54,16.26 U401.21 | v34.27,17.88 33.63,17.88 33.55,17.8 33.1,17.8 32.05,18.85 32.05,19.07 29.54,21.59 J401.4
  Bottom 0.152: v37.24,14.83 37.24,14.91 v34.27,17.88
RX1  (via drill 0.33)
  Top 0.152: v20.68,4.55 21.08,4.14 21.08,3.86 R501.1 | v18.75,3.25 18.75,3.96 18.67,4.04 Q501.3 | v28.8,13.28 29.41,13.89 30.2,13.89 U401.34 | v26.16,7.34 v27.64,8.81
  Bottom 0.152: v18.75,3.25 20.04,4.55 v20.68,4.55 23.47,7.34 v26.16,7.34 | v28.8,13.28 28.8,9.98 v27.64,8.81
RX_I  (via drill 0.33)
  Top 0.152: R501.2 20.7,3.3 19.96,4.04 Q501.1 20.12,3.79 v19.58,3.25 | v17.73,2.41 15.72,2.41 15.49,2.64 15.49,3.05 J501.RX
  Bottom 0.152: v17.73,2.41 18.75,2.41 v19.58,3.25
SCK0  (via drill 0.33)
  Top 0.152: v35.05,13.21 35.05,14.99 34.57,15.47 34.57,16.26 U401.27
  Bottom 0.152: v35.05,13.21 35.05,7.34 J701.5
SCL0  (via drill 0.33)
  Top 0.152: 25.4,19.81 25.4,19.33 25.88,18.85 R401.4 | 25.4,19.81 25.76,20.17 26.39,20.17 v27.51,19.05 | v36.37,14.96 36.55,14.96 37.06,15.47 37.06,16.26 U401.22 | 6.88,14.33 6.88,15.16 8.64,16.92 U101.5 | 6.88,14.33 6.88,13.41 U601.23 | U902.14 12.19,3.56 12.55,3.2 v12.55,2.36 | v6.96,14.33 6.88,14.33 | v24.71,20.04 24.89,19.86 25.35,19.86 25.4,19.81
  Bottom 0.152: v27.51,19.05 28.52,19.05 31.06,16.51 34.82,16.51 v36.37,14.96 | v12.55,2.36 11.81,2.36 11.4,1.96 6.38,1.96 5.46,2.87 5.46,13.39 6.4,14.33 v6.96,14.33 12.68,20.04 v24.71,20.04
SDA0  (via drill 0.33)
  Top 0.152: v30.63,19.63 31.06,19.63 31.75,18.95 31.75,18.72 33.17,17.3 34.82,17.3 35.05,17.07 U401.26 | R401.3 26.31,18.29 v26.7,18.67 26.64,18.72 26.64,18.92 v25.98,19.58 | U601.24 6.38,15.09 8.1,16.82 8.1,17.8 8.23,17.93 9.3,17.93 U101.6 9.98,17.14 v9.98,15.98 | v11.96,2.97 11.46,2.46 U902.13
  Bottom 0.152: v26.7,18.67 26.7,19.05 27.28,19.63 v30.63,19.63 | 11.96,13.99 v11.96,2.97 | v9.98,15.98 11.96,13.99 | v25.98,19.58 25.07,19.58 21.16,15.67 13.64,15.67 11.96,13.99
TX0  (via drill 0.33)
  Top 0.152: v36.63,19.25 38.56,17.32 U401.19 | v33.58,19.46 33.58,19.76 J401.3
  Bottom 0.152: v36.63,19.25 35.51,19.25 35.43,19.18 33.86,19.18 v33.58,19.46
TX1  (via drill 0.33)
  Top 0.152: 20.68,2.23 20.14,2.23 19.96,2.06 Q501.6 | 20.68,2.23 21.08,2.23 R501.4 | v20.68,1.55 20.68,2.23 | v26.16,8.23 26.16,8.48 27.64,9.96 27.64,12.93 29.11,14.4 30.2,14.4 U401.33
  Bottom 0.152: v20.68,1.55 21.18,1.55 26.75,7.11 26.75,7.64 v26.16,8.23
TX_O
  Top 0.152: R501.3 19.94,2.79 19.74,2.59 18.97,2.59 18.67,2.29 18.67,2.06 Q501.4 18.62,2.34 17.91,3.05 J501.TX
USB_ON  (via drill 0.33)
  Top 0.152: v39.01,8.61 39.01,8.31 36.58,5.87 36.58,5.08 U401.58 | v24.77,10.64 24.77,11.76 25.53,12.52 S458.P$2
  Bottom 0.152: 43.48,3.68 40.39,6.78 39.4,6.78 39.01,7.16 v39.01,8.61 | 43.48,3.68 44.07,3.1 44.98,3.1 46.76,4.88 48.01,4.88 R015.2 | v24.77,10.64 24.77,10.44 27.08,8.13 27.08,7.75 33.12,1.7 41.5,1.7 43.48,3.68
USB_SOFTCONNECT  (via drill 0.33)
  Top 0.152: v51.97,6.91 51.97,16.79 48.97,19.79 47.62,19.79 47.09,19.25 47.09,16.71 46.58,16.2 45.54,16.2 44.45,17.3 41.99,17.3 41.94,17.25 41.17,17.25 40.82,17.6 40.82,17.73 39.7,18.85 39.24,18.85 38.89,18.49 38.89,18.03 39.55,17.37 39.55,16.28 U401.17
  Bottom 0.152: 49.07,4.01 49.45,3.63 Q050.1 | 49.07,4.01 49.02,4.06 49.02,4.24 R015.4 | 49.07,4.01 v51.97,6.91
USBD+  (via drill 0.33)
  Top 0.152: v47.22,16.03 47.22,16.41 47.47,16.66 47.47,17.65 v47.68,17.86 | v38.43,13.16 38.89,13.16 40.62,11.43 U401.10
  Bottom 0.152: R023.3 48.03,10.11 48.13,10.11 48.51,10.49 48.51,12.12 48.13,12.5 48.03,12.5 C023.2 47.98,12.57 47.98,12.72 47.22,13.49 v47.22,16.03 | v47.68,17.86 47.3,17.86 45.49,19.66 45.09,19.66 42.57,22.17 41.66,22.17 41.3,21.82 41.3,21.16 41.15,21.01 40.31,21.01 39.98,20.68 39.98,20.12 38.43,18.57 36.58,18.57 36.42,18.41 36.42,16.46 37.85,15.04 37.85,13.74 v38.43,13.16
USBD-  (via drill 0.33)
  Top 0.152: v45.24,11.43 45.03,11.43 43.71,12.75 42.98,12.75 42.44,12.22 42.44,12.17 42.22,11.94 41.43,11.94 U401.11
  Bottom 0.152: 48.03,11.53 48.03,11.86 C023.1 | 48.03,11.53 48.03,10.74 R023.4 | 48.03,11.53 45.34,11.53 v45.24,11.43
VBUS  (via drill 0.33)
  Top 0.152: v40.23,16.13 40.23,14.5 v39.9,14.17 | v41.4,17.83 42.82,17.83 v44.07,19.07
  Bottom 0.152: v40.23,16.13 40.44,16.33 40.44,17.25 D302.1 40.51,17.3 40.87,17.3 v41.4,17.83 | v39.9,14.17 39.9,13.03 40.44,12.5 U301.4 | 50.37,8.03 50.37,7.42 49.02,6.07 49.02,4.9 R015.3 | 50.37,8.03 49.23,9.17 49.02,9.17 R053.5 | D402.C 42.09,21.59 42.09,20.34 42.06,20.32 C302.1 42.14,20.3 44.02,20.3 44.65,19.66 | 44.65,19.66 45.57,18.75 45.97,18.75 49.12,15.6 49.12,14.02 R011.2 49.51,13.97 50.72,12.75 51.77,12.75 J001.1 51.84,12.7 52.4,12.7 53.09,12.01 53.09,8.43 52.73,8.08 50.42,8.08 50.37,8.03 | 44.65,19.66 v44.07,19.07
VCC  (via drill 0.33)
  Top 0.152: Y601.4 2.18,12.09 2.03,12.24 C601.2 2.01,13.39 2.01,13.51 1.35,14.17 1.35,15.06 6.25,19.96 7.06,19.96 U101.3 7.14,20.02 7.95,20.83 8,20.83 | 8,20.83 8,20.65 8.64,20.02 U101.2 | 8,20.83 C101.1 8.05,21.64 8.2,21.64 8.84,22.28 23.44,22.28 J401.6 24.13,19.63 24.87,18.9 R401.5 24.92,18.82 24.92,18.34 R401.6 24.92,18.26 24.92,17.86 R401.7 24.92,17.78 24.92,17.25 R401.8 | U401.23 36.47,16.36 36.47,18.29 C423.1 36.42,18.34 36.42,18.54 v35.2,19.76 | R401.8 24.97,17.2 25.38,16.79 27.05,16.79 28.17,17.91 28.73,17.91 D401.6 28.8,17.96 D401.4 29.52,17.96 30.12,17.96 D401.2 30.18,17.98 v31.04,18.85 | v23.7,17.2 24.84,17.2 R401.8 | 44.63,4.27 46.71,4.27 46.83,4.38 | 44.63,4.27 44.48,4.27 44.35,4.39 44.35,4.65 43.97,5.03 43,5.03 42.32,5.71 41.91,5.71 C463.1 | 46.83,4.38 47.73,5.28 Y403.4 47.14,4.8 v47.14,8.15 | 44.63,4.27 v44.63,3.99 44.4,4.24 43.99,3.83 42.67,3.83 | 42.67,3.83 39.52,3.83 39.06,4.29 39.06,5.05 U401.63 | 46.83,4.38 v47.22,3.99 | C443.1 30.12,9.5 U401.43 30.28,9.45 31.04,9.45 31.17,9.58 32.33,9.58 32.66,9.91 34.01,9.91 | 34.01,9.91 41.4,9.91 U401.7 | U601.13 10.85,10.19 C613.2 10.79,10.13 10.79,8.48 | C901.1 10.85,6.35 10.85,4.7 10.87,4.67 U902.1 | 10.79,8.48 10.79,6.4 C901.1 | U902.7 6.81,3.56 6.81,4.57 U902.6 6.76,4.62 v6.04,4.62 | 6.86,7.32 6.86,6.45 C906.1 6.83,6.33 8.87,6.33 8.91,6.38 10.72,6.38 C901.1 | 6.86,7.32 6.86,8.79 | 6.86,8.79 6.86,9.45 U601.8 | 6.86,8.79 6.07,8.79 4.95,9.91 4.95,11.46 5.16,11.66 5.61,11.66 U601.3 | v6.81,7.32 6.86,7.32 | 33.15,3.81 33.15,4.98 33.07,5.05 U401.51 | 33.15,3.81 33.15,3.76 | 33.15,3.76 C451.1 | 33.15,3.76 33.53,3.76
  Top 0.152: 33.53,3.76 v33.96,3.76 | 22.38,3.76 22.3,3.83 22.1,3.83 R501.8 22.07,3.91 22.07,4.39 20.09,6.38 18.26,6.38 | 22.38,3.76 22.58,3.56 22.58,2.54 22.3,2.26 22.1,2.26 R501.5 | 18.26,6.38 18.26,6.6 17.98,6.88 17.78,6.88 R502.8 17.75,6.96 17.75,7.52 17.09,8.18 | 18.26,6.38 18.26,5.59 17.98,5.31 R502.5 | 33.15,3.81 22.43,3.81 22.38,3.76 | 10.79,8.48 16.79,8.48 17.09,8.18 | v34.01,8.38 34.01,9.91 | v42.67,3.68 42.67,3.83 | v34.65,2.59 33.53,3.71 33.53,3.76 | 17.09,8.18 v17.3,8.38
  Bottom 0.152: v23.7,17.2 21.51,15.01 C501.1 21.44,14.99 21.44,13.79 21.16,13.51 U501.1 21.11,13.44 21.11,12.19 v17.3,8.38 | v35.2,19.76 34.09,19.76 33.81,20.04 32.23,20.04 v31.04,18.85 | 47.57,3.63 48.01,4.06 R015.1 | 47.57,3.63 47.57,1.29 Q050.2 | v44.63,3.99 44.32,4.29 44.32,6.1 C205.1 | v47.14,8.15 46.02,8.15 44.32,9.86 44.02,9.86 U201.5 | v47.22,3.99 47.57,3.63 | v6.04,4.62 6.04,6.55 v6.81,7.32 | v33.96,3.76 33.96,7.11 J701.4 34.01,7.19 v34.01,8.38 | v42.67,3.68 40.79,3.68 39.7,2.59 v34.65,2.59
VIN  (via drill 0.33)
  Top 0.152: S201.6 42.65,16.54 43.48,15.7 v43.48,15.57 44.12,14.94 v44.55,14.94
  Bottom 0.152: U201.1 44.02,12.5 44.3,12.78 44.3,13.97 C201.1 44.35,14.02 44.35,14.73 v44.55,14.94 | v43.48,15.57 42.88,14.96 42.42,14.96 42.24,15.14 41.4,15.14 D302.3
VLIPO  (via drill 0.33)
  Top 0.152: v30.76,3.23 31.04,2.95 C449.2 | v29.59,4.39 v31.39,4.39 32.05,5.05 U401.49 | v40.97,5.16 40.97,5.92 41.55,6.5 v42.67,6.5 | v42.65,15.54 47.75,10.44 J301.2
  Bottom 0.152: v29.59,4.39 v30.76,3.23 | R302.2 41.91,18.14 42.34,17.7 42.34,17.27 D302.2 42.27,17.27 42.19,17.27 41.55,16.64 | 41.55,16.64 39.32,14.4 39.32,11.02 40.41,9.93 U301.3 40.46,9.86 40.74,9.58 C301.1 40.82,8.36 v42.67,6.5 | v31.39,4.39 32.38,4.39 33.6,3.17 39.85,3.17 40.97,4.29 v40.97,5.16 | 41.55,16.64 v42.65,15.54
XTAL1
  Top 0.152: C404.1 40.44,2.95 C462.2 38.96,2.95 Y401.1 38.94,3.02 38.58,3.38 38.58,5.05 U401.62
XTAL2
  Top 0.152: C461.2 35.81,1.65 37.24,1.65 Y401.3 37.31,1.68 37.41,1.68 38.1,2.36 38.1,3.53 38.08,3.56 38.08,5.05 U401.61

### Text on the board
tPlace: 3V3 | BSL | RX0 | TX0 | GND | VBUS | On | Baro | 9DoF | Boot | Charge | USB | Reset | HighAcc | stkwans.blogspot.com
bPlace: VBUS | 3V3 | BSL | RX0 | TX0 | GND | St Kwan's Home for | the Terminally ADD | v1.0 01 Apr 2014 | a division of | Kwan Systems | RocketometerMPU9150